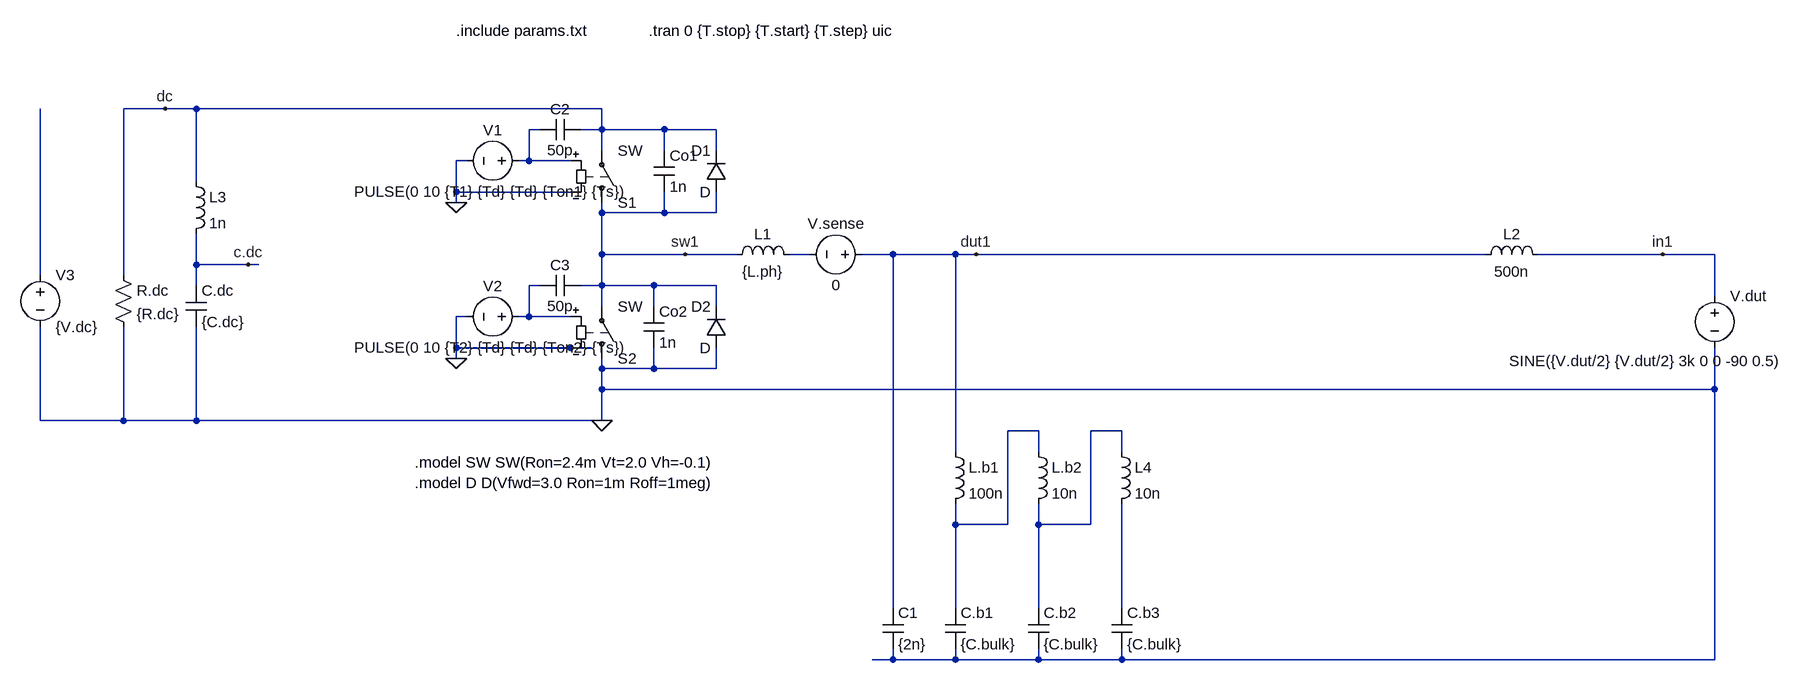
[diagram p0: schematic sim.asc]
sim.asc, the LTspice schematic file:
Version 4
SHEET 1 2248 920
WIRE -272 64 -336 64
WIRE -224 64 -272 64
WIRE 400 64 -224 64
WIRE 304 96 288 96
WIRE 400 96 400 64
WIRE 400 96 368 96
WIRE 496 96 400 96
WIRE 576 96 496 96
WIRE 400 128 400 96
WIRE 496 128 496 96
WIRE 576 128 576 96
WIRE 192 144 176 144
WIRE 288 144 288 96
WIRE 288 144 272 144
WIRE 352 144 288 144
WIRE -224 176 -224 64
WIRE 176 192 176 144
WIRE 352 192 176 192
WIRE 176 208 176 192
WIRE 400 224 400 208
WIRE 496 224 496 192
WIRE 496 224 400 224
WIRE 576 224 576 192
WIRE 576 224 496 224
WIRE 400 288 400 224
WIRE 528 288 400 288
WIRE 608 288 528 288
WIRE 720 288 688 288
WIRE 848 288 800 288
WIRE 944 288 848 288
WIRE 976 288 944 288
WIRE 1760 288 976 288
WIRE 2032 288 1840 288
WIRE 2112 288 2032 288
WIRE -224 304 -224 256
WIRE -144 304 -224 304
WIRE -128 304 -144 304
WIRE -464 320 -464 64
WIRE -336 320 -336 64
WIRE -224 336 -224 304
WIRE 304 336 288 336
WIRE 400 336 400 288
WIRE 400 336 368 336
WIRE 480 336 400 336
WIRE 576 336 480 336
WIRE 2112 352 2112 288
WIRE 400 368 400 336
WIRE 480 368 480 336
WIRE 576 368 576 336
WIRE 192 384 176 384
WIRE 288 384 288 336
WIRE 288 384 272 384
WIRE 352 384 288 384
WIRE 176 432 176 384
WIRE 352 432 176 432
WIRE 384 432 352 432
WIRE 176 448 176 432
WIRE 400 464 400 448
WIRE 480 464 480 432
WIRE 480 464 400 464
WIRE 576 464 576 432
WIRE 576 464 480 464
WIRE 400 496 400 464
WIRE 2112 496 2112 432
WIRE 2112 496 400 496
WIRE -464 544 -464 400
WIRE -336 544 -336 400
WIRE -336 544 -464 544
WIRE -224 544 -224 400
WIRE -224 544 -336 544
WIRE 400 544 400 496
WIRE 400 544 -224 544
WIRE 1072 560 1024 560
WIRE 1200 560 1152 560
WIRE 944 592 944 288
WIRE 1072 592 1072 560
WIRE 1200 592 1200 560
WIRE 944 704 944 672
WIRE 1024 704 1024 560
WIRE 1024 704 944 704
WIRE 1072 704 1072 672
WIRE 1152 704 1152 560
WIRE 1152 704 1072 704
WIRE 848 832 848 288
WIRE 944 832 944 704
WIRE 1072 832 1072 704
WIRE 1200 832 1200 672
WIRE 848 912 848 896
WIRE 848 912 816 912
WIRE 944 912 944 896
WIRE 944 912 848 912
WIRE 1072 912 1072 896
WIRE 1072 912 944 912
WIRE 1200 912 1200 896
WIRE 1200 912 1072 912
WIRE 2112 912 2112 496
WIRE 2112 912 1200 912
FLAG 400 544 0
FLAG 176 208 0
FLAG 176 448 0
FLAG 528 288 sw1
FLAG 2032 288 in1
FLAG -272 64 dc
FLAG 976 288 dut1
FLAG -144 304 c.dc
SYMBOL voltage 288 144 R90
WINDOW 0 -32 56 VBottom 2
WINDOW 3 32 56 VTop 2
SYMATTR InstName V1
SYMATTR Value PULSE(0 10 {T1} {Td} {Td} {Ton1} {Ts})
SYMBOL voltage 288 384 R90
WINDOW 0 -32 56 VBottom 2
WINDOW 3 32 56 VTop 2
SYMATTR InstName V2
SYMATTR Value PULSE(0 10 {T2} {Td} {Td} {Ton2} {Ts})
SYMBOL voltage 2112 336 R0
WINDOW 3 -316 116 Left 2
SYMATTR InstName V.dut
SYMATTR Value SINE({V.dut/2} {V.dut/2} 3k 0 0 -90 0.5)
SYMBOL ind 592 304 R270
WINDOW 0 32 56 VTop 2
WINDOW 3 5 56 VBottom 2
SYMATTR InstName L1
SYMATTR Value {L.ph}
SYMATTR SpiceLine Rser={R.ph.s} Rpar={R.ph.p}
SYMBOL cap -240 336 R0
SYMATTR InstName C.dc
SYMATTR Value {C.dc}
SYMBOL res -352 304 R0
SYMATTR InstName R.dc
SYMATTR Value {R.dc}
SYMBOL voltage 816 288 R90
WINDOW 0 -32 56 VBottom 2
WINDOW 3 32 56 VTop 2
SYMATTR InstName V.sense
SYMATTR Value 0
SYMBOL voltage -464 304 R0
SYMATTR InstName V3
SYMATTR Value {V.dc}
SYMBOL ind 1744 304 R270
WINDOW 0 32 56 VTop 2
WINDOW 3 5 56 VBottom 2
SYMATTR InstName L2
SYMATTR Value 500n
SYMATTR SpiceLine Rser=1m Rpar=10k
SYMBOL ind -240 160 R0
SYMATTR InstName L3
SYMATTR Value 1n
SYMATTR SpiceLine Rser=1m Rpar=5
SYMBOL cap 928 832 R0
SYMATTR InstName C.b1
SYMATTR Value {C.bulk}
SYMBOL ind 928 576 R0
SYMATTR InstName L.b1
SYMATTR Value 100n
SYMBOL cap 1056 832 R0
SYMATTR InstName C.b2
SYMATTR Value {C.bulk}
SYMBOL cap 1184 832 R0
SYMATTR InstName C.b3
SYMATTR Value {C.bulk}
SYMBOL ind 1056 576 R0
SYMATTR InstName L.b2
SYMATTR Value 10n
SYMBOL ind 1184 576 R0
SYMATTR InstName L4
SYMATTR Value 10n
SYMBOL cap 832 832 R0
SYMATTR InstName C1
SYMATTR Value {2n}
SYMBOL sw 400 224 M180
SYMATTR InstName S1
SYMBOL sw 400 464 M180
SYMATTR InstName S2
SYMBOL cap 480 128 R0
SYMATTR InstName Co1
SYMATTR Value 1n
SYMATTR SpiceLine Rser=1m
SYMBOL cap 464 368 R0
SYMATTR InstName Co2
SYMATTR Value 1n
SYMATTR SpiceLine Rser=1m
SYMBOL Diode 592 432 R180
WINDOW 0 24 64 Left 2
WINDOW 3 24 0 Left 2
SYMATTR InstName D2
SYMBOL Diode 592 192 R180
WINDOW 0 24 64 Left 2
WINDOW 3 24 0 Left 2
SYMATTR InstName D1
SYMBOL cap 368 80 R90
WINDOW 0 0 32 VBottom 2
WINDOW 3 32 32 VTop 2
SYMATTR InstName C2
SYMATTR Value 50p
SYMBOL cap 368 320 R90
WINDOW 0 0 32 VBottom 2
WINDOW 3 32 32 VTop 2
SYMATTR InstName C3
SYMATTR Value 50p
TEXT 176 -56 Left 2 !.include params.txt
TEXT 472 -56 Left 2 !.tran 0 {T.stop} {T.start} {T.step} uic
TEXT 112 608 Left 2 !.model SW SW(Ron=2.4m Vt=2.0 Vh=-0.1)
TEXT 112 640 Left 2 !.model D D(Vfwd=3.0 Ron=1m Roff=1meg)

The netlist it stands for:
* sim.asc
V1 N001 0 PULSE(0 10 {T1} {Td} {Td} {Ton1} {Ts})
V2 N004 0 PULSE(0 10 {T2} {Td} {Td} {Ton2} {Ts})
V.dut in1 0 SINE({V.dut/2} {V.dut/2} 3k 0 0 -90 0.5)
L1 sw1 N002 {L.ph} Rser={R.ph.s} Rpar={R.ph.p}
C.dc c.dc 0 {C.dc}
R.dc dc 0 {R.dc}
V.sense dut1 N002 0
V3 N003 0 {V.dc}
L2 dut1 in1 500n Rser=1m Rpar=10k
L3 dc c.dc 1n Rser=1m Rpar=5
C.b1 N005 0 {C.bulk}
L.b1 dut1 N005 100n
C.b2 N006 0 {C.bulk}
C.b3 N007 0 {C.bulk}
L.b2 N005 N006 10n
L4 N006 N007 10n
C1 dut1 0 {2n}
S1 sw1 dc N001 0 SW
S2 0 sw1 N004 0 SW
Co1 dc sw1 1n Rser=1m
Co2 sw1 0 1n Rser=1m
D2 0 sw1 D
D1 sw1 dc D
C2 dc N001 50p
C3 sw1 N004 50p
.model D D
.lib standard.dio
.include params.txt
.tran 0 {T.stop} {T.start} {T.step} uic
.model SW SW(Ron=2.4m Vt=2.0 Vh=-0.1)
.model D D(Vfwd=3.0 Ron=1m Roff=1meg)
.backanno
.end